# Altium schematic sheet DDR3.SchDoc
size A3
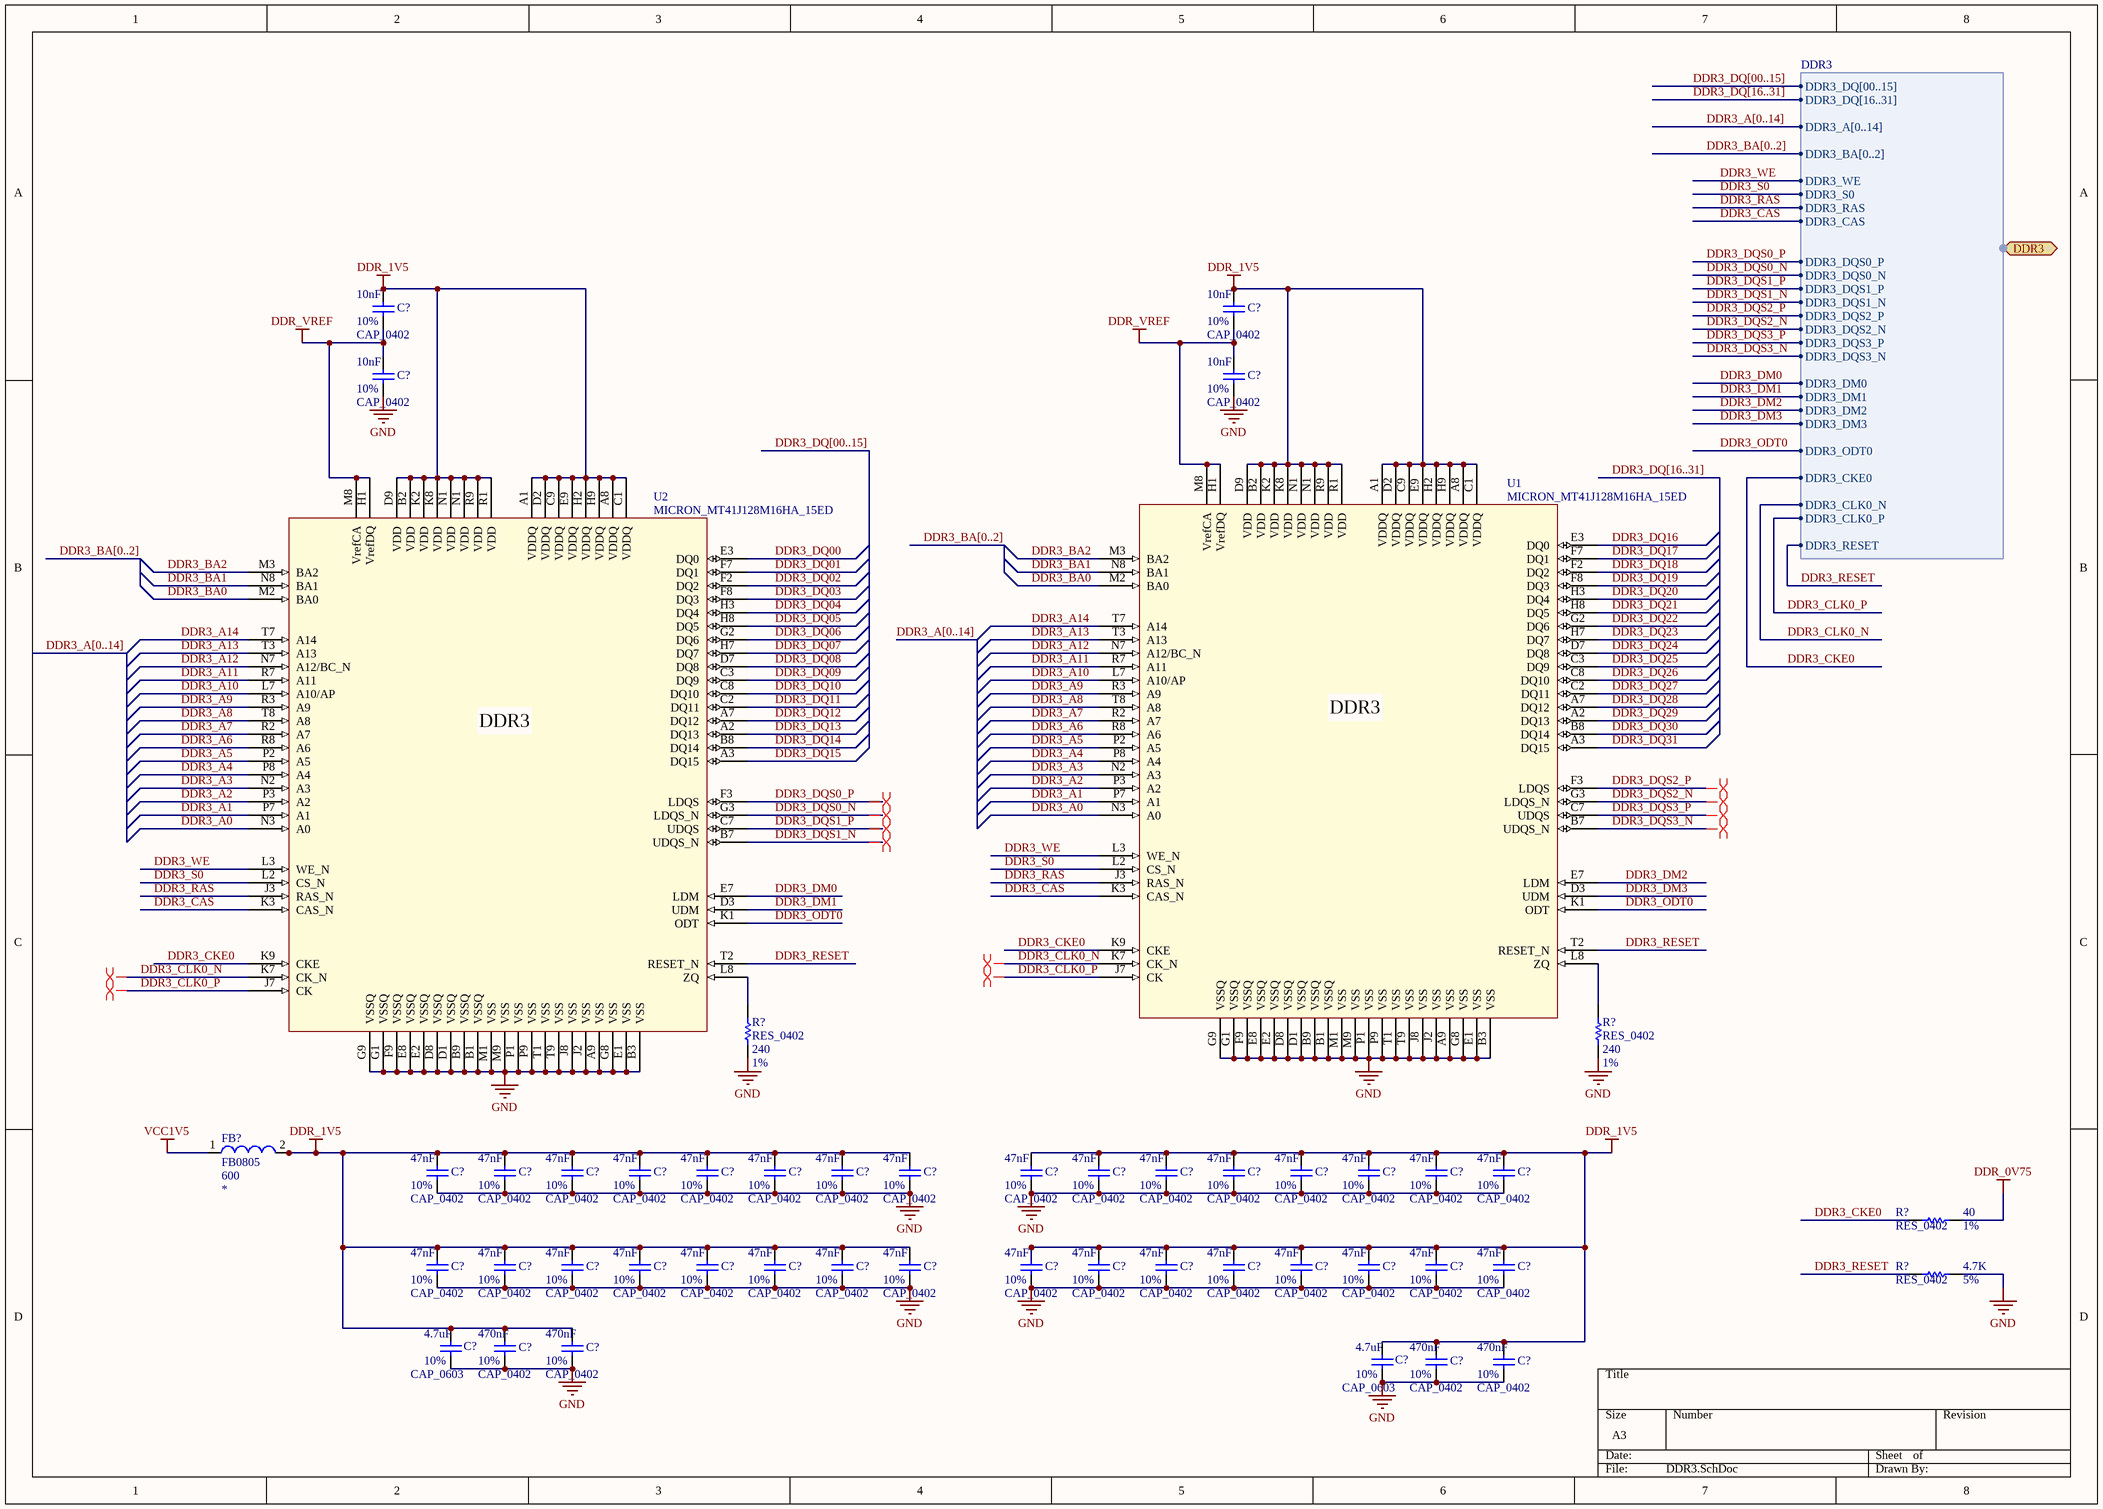
[diagram p0: DDR3.SchDoc]

## Parts
(Parts that share a designator on the sheet are numbered #1, #2 ... from top to bottom, then left to right.)
C?#1  CAP_0402  value 10nF  Tolerance: 10%  [CAPC0402(1005)60_N]
C?#2  CAP_0402  value 10nF  Tolerance: 10%  [CAPC0402(1005)60_N]
C?#3  CAP_0402  value 10nF  Tolerance: 10%  [CAPC0402(1005)60_N]
C?#4  CAP_0402  value 10nF  Tolerance: 10%  [CAPC0402(1005)60_N]
C?#5  CAP_0402  value 47nF  Tolerance: 10%  [CAPC0402(1005)60_N]
C?#6  CAP_0402  value 47nF  Tolerance: 10%  [CAPC0402(1005)60_N]
C?#7  CAP_0402  value 47nF  Tolerance: 10%  [CAPC0402(1005)60_N]
C?#8  CAP_0402  value 47nF  Tolerance: 10%  [CAPC0402(1005)60_N]
C?#9  CAP_0402  value 47nF  Tolerance: 10%  [CAPC0402(1005)60_N]
C?#10  CAP_0402  value 47nF  Tolerance: 10%  [CAPC0402(1005)60_N]
C?#11  CAP_0402  value 47nF  Tolerance: 10%  [CAPC0402(1005)60_N]
C?#12  CAP_0402  value 47nF  Tolerance: 10%  [CAPC0402(1005)60_N]
C?#13  CAP_0402  value 47nF  Tolerance: 10%  [CAPC0402(1005)60_N]
C?#14  CAP_0402  value 47nF  Tolerance: 10%  [CAPC0402(1005)60_N]
C?#15  CAP_0402  value 47nF  Tolerance: 10%  [CAPC0402(1005)60_N]
C?#16  CAP_0402  value 47nF  Tolerance: 10%  [CAPC0402(1005)60_N]
C?#17  CAP_0402  value 47nF  Tolerance: 10%  [CAPC0402(1005)60_N]
C?#18  CAP_0402  value 47nF  Tolerance: 10%  [CAPC0402(1005)60_N]
C?#19  CAP_0402  value 47nF  Tolerance: 10%  [CAPC0402(1005)60_N]
C?#20  CAP_0402  value 47nF  Tolerance: 10%  [CAPC0402(1005)60_N]
C?#21  CAP_0402  value 47nF  Tolerance: 10%  [CAPC0402(1005)60_N]
C?#22  CAP_0402  value 47nF  Tolerance: 10%  [CAPC0402(1005)60_N]
C?#23  CAP_0402  value 47nF  Tolerance: 10%  [CAPC0402(1005)60_N]
C?#24  CAP_0402  value 47nF  Tolerance: 10%  [CAPC0402(1005)60_N]
C?#25  CAP_0402  value 47nF  Tolerance: 10%  [CAPC0402(1005)60_N]
C?#26  CAP_0402  value 47nF  Tolerance: 10%  [CAPC0402(1005)60_N]
C?#27  CAP_0402  value 47nF  Tolerance: 10%  [CAPC0402(1005)60_N]
C?#28  CAP_0402  value 47nF  Tolerance: 10%  [CAPC0402(1005)60_N]
C?#29  CAP_0402  value 47nF  Tolerance: 10%  [CAPC0402(1005)60_N]
C?#30  CAP_0402  value 47nF  Tolerance: 10%  [CAPC0402(1005)60_N]
C?#31  CAP_0402  value 47nF  Tolerance: 10%  [CAPC0402(1005)60_N]
C?#32  CAP_0402  value 47nF  Tolerance: 10%  [CAPC0402(1005)60_N]
C?#33  CAP_0402  value 47nF  Tolerance: 10%  [CAPC0402(1005)60_N]
C?#34  CAP_0402  value 47nF  Tolerance: 10%  [CAPC0402(1005)60_N]
C?#35  CAP_0402  value 47nF  Tolerance: 10%  [CAPC0402(1005)60_N]
C?#36  CAP_0402  value 47nF  Tolerance: 10%  [CAPC0402(1005)60_N]
C?#37  CAP_0603  value 4.7uF  Tolerance: 10%  [CAPC0603(1608)100_N]
C?#38  CAP_0402  value 470nF  Tolerance: 10%  [CAPC0402(1005)60_N]
C?#39  CAP_0402  value 470nF  Tolerance: 10%  [CAPC0402(1005)60_N]
C?#40  CAP_0603  value 4.7uF  Tolerance: 10%  [CAPC0603(1608)100_N]
C?#41  CAP_0402  value 470nF  Tolerance: 10%  [CAPC0402(1005)60_N]
C?#42  CAP_0402  value 470nF  Tolerance: 10%  [CAPC0402(1005)60_N]
FB?  FB0805  Resistance: 600  [FerriteBead0805_WurthElectronik]
R?#1  RES_0402  value 240  Tolerance: 1%  [RESC0402(1005)_N]
R?#2  RES_0402  value 240  Tolerance: 1%  [RESC0402(1005)_N]
R?#3  RES_0402  value 40  Tolerance: 1%  [RESC0402(1005)_N]
R?#4  RES_0402  value 4.7K  Tolerance: 5%  [RESC0402(1005)_N]
U1  MICRON_MT41J128M16HA_15ED
U2  MICRON_MT41J128M16HA_15ED

## Ports
DDR3 (harness DDR3)

## Harnesses
DDR3: DDR3_DQ[00..15], DDR3_DQ[16..31], DDR3_A[0..14], DDR3_BA[0..2], DDR3_WE, DDR3_S0, DDR3_RAS, DDR3_CAS, DDR3_DQS0_P, DDR3_DQS0_N, DDR3_DQS1_P, DDR3_DQS1_N, DDR3_DQS2_P, DDR3_DQS2_N, DDR3_DQS3_P, DDR3_DQS3_N, DDR3_DM0, DDR3_DM1, DDR3_DM2, DDR3_DM3, DDR3_ODT0, DDR3_CKE0, DDR3_CLK0_N, DDR3_CLK0_P, DDR3_RESET

## Nets
DDR_0V75: R?#3.2
DDR_1V5: C?#1.2 C?#2.2 C?#5.2 C?#6.2 C?#7.2 C?#8.2 C?#9.2 C?#10.2 C?#11.2 C?#12.2 C?#13.2 C?#14.2 C?#15.2 C?#16.2 C?#17.2 C?#18.2 C?#19.2 C?#20.2 C?#21.2 C?#22.2 C?#23.2 C?#24.2 C?#25.2 C?#26.2 C?#27.2 C?#28.2 C?#29.2 C?#30.2 C?#31.2 C?#32.2 C?#33.2 C?#34.2 C?#35.2 C?#36.2 C?#37.2 C?#38.2 C?#39.2 C?#40.2 C?#41.2 C?#42.2 FB?.2 U1.A1(VDDQ) U1.A8(VDDQ) U1.B2(VDD) U1.C1(VDDQ) U1.C9(VDDQ) U1.D2(VDDQ) U1.D9(VDD) U1.E9(VDDQ) U1.H2(VDDQ) U1.H9(VDDQ) U1.K2(VDD) U1.K8(VDD) U1.N1(VDD) U1.R1(VDD) U1.R9(VDD) U2.A1(VDDQ) U2.A8(VDDQ) U2.B2(VDD) U2.C1(VDDQ) U2.C9(VDDQ) U2.D2(VDDQ) U2.D9(VDD) U2.E9(VDDQ) U2.H2(VDDQ) U2.H9(VDDQ) U2.K2(VDD) U2.K8(VDD) U2.N1(VDD) U2.R1(VDD) U2.R9(VDD)
DDR_VREF: C?#1.1 C?#2.1 C?#3.2 C?#4.2 U1.H1(VrefDQ) U1.M8(VrefCA) U2.H1(VrefDQ) U2.M8(VrefCA)
GND: C?#3.1 C?#4.1 C?#5.1 C?#6.1 C?#7.1 C?#8.1 C?#9.1 C?#10.1 C?#11.1 C?#12.1 C?#13.1 C?#14.1 C?#15.1 C?#16.1 C?#17.1 C?#18.1 C?#19.1 C?#20.1 C?#21.1 C?#22.1 C?#23.1 C?#24.1 C?#25.1 C?#26.1 C?#27.1 C?#28.1 C?#29.1 C?#30.1 C?#31.1 C?#32.1 C?#33.1 C?#34.1 C?#35.1 C?#36.1 C?#37.1 C?#38.1 C?#39.1 C?#40.1 C?#41.1 C?#42.1 R?#1.1 R?#2.1 R?#4.2 U1.A9(VSS) U1.B1(VSSQ) U1.B3(VSS) U1.B9(VSSQ) U1.D1(VSSQ) U1.D8(VSSQ) U1.E1(VSS) U1.E2(VSSQ) U1.E8(VSSQ) U1.F9(VSSQ) U1.G1(VSSQ) U1.G8(VSS) U1.G9(VSSQ) U1.J2(VSS) U1.J8(VSS) U1.M1(VSS) U1.M9(VSS) U1.P1(VSS) U1.P9(VSS) U1.T1(VSS) U1.T9(VSS) U2.A9(VSS) U2.B1(VSSQ) U2.B3(VSS) U2.B9(VSSQ) U2.D1(VSSQ) U2.D8(VSSQ) U2.E1(VSS) U2.E2(VSSQ) U2.E8(VSSQ) U2.F9(VSSQ) U2.G1(VSSQ) U2.G8(VSS) U2.G9(VSSQ) U2.J2(VSS) U2.J8(VSS) U2.M1(VSS) U2.M9(VSS) U2.P1(VSS) U2.P9(VSS) U2.T1(VSS) U2.T9(VSS)
VCC1V5: FB?.1
DDR3_A0: U1.N3(A0) U2.N3(A0)
DDR3_A1: U1.P7(A1) U2.P7(A1)
DDR3_A2: U1.P3(A2) U2.P3(A2)
DDR3_A3: U1.N2(A3) U2.N2(A3)
DDR3_A4: U1.P8(A4) U2.P8(A4)
DDR3_A5: U1.P2(A5) U2.P2(A5)
DDR3_A6: U1.R8(A6) U2.R8(A6)
DDR3_A7: U1.R2(A7) U2.R2(A7)
DDR3_A8: U1.T8(A8) U2.T8(A8)
DDR3_A9: U1.R3(A9) U2.R3(A9)
DDR3_A10: U1.L7(A10/AP) U2.L7(A10/AP)
DDR3_A11: U1.R7(A11) U2.R7(A11)
DDR3_A12: U1.N7(A12/BC_N) U2.N7(A12/BC_N)
DDR3_A13: U1.T3(A13) U2.T3(A13)
DDR3_A14: U1.T7(A14) U2.T7(A14)
DDR3_BA0: U1.M2(BA0) U2.M2(BA0)
DDR3_BA1: U1.N8(BA1) U2.N8(BA1)
DDR3_BA2: U1.M3(BA2) U2.M3(BA2)
DDR3_CAS: U1.K3(CAS_N) U2.K3(CAS_N) ; port DDR3.DDR3_CAS
DDR3_CKE0: R?#3.1 U1.K9(CKE) U2.K9(CKE) ; port DDR3.DDR3_CKE0
DDR3_CLK0_N: U1.K7(CK_N) U2.K7(CK_N) ; port DDR3.DDR3_CLK0_N
DDR3_CLK0_P: U1.J7(CK) U2.J7(CK) ; port DDR3.DDR3_CLK0_P
DDR3_DM0: U2.E7(LDM) ; port DDR3.DDR3_DM0
DDR3_DM1: U2.D3(UDM) ; port DDR3.DDR3_DM1
DDR3_DM2: U1.E7(LDM) ; port DDR3.DDR3_DM2
DDR3_DM3: U1.D3(UDM) ; port DDR3.DDR3_DM3
DDR3_DQ00: U2.E3(DQ0)
DDR3_DQ01: U2.F7(DQ1)
DDR3_DQ02: U2.F2(DQ2)
DDR3_DQ03: U2.F8(DQ3)
DDR3_DQ04: U2.H3(DQ4)
DDR3_DQ05: U2.H8(DQ5)
DDR3_DQ06: U2.G2(DQ6)
DDR3_DQ07: U2.H7(DQ7)
DDR3_DQ08: U2.D7(DQ8)
DDR3_DQ09: U2.C3(DQ9)
DDR3_DQ10: U2.C8(DQ10)
DDR3_DQ11: U2.C2(DQ11)
DDR3_DQ12: U2.A7(DQ12)
DDR3_DQ13: U2.A2(DQ13)
DDR3_DQ14: U2.B8(DQ14)
DDR3_DQ15: U2.A3(DQ15)
DDR3_DQ16: U1.E3(DQ0)
DDR3_DQ17: U1.F7(DQ1)
DDR3_DQ18: U1.F2(DQ2)
DDR3_DQ19: U1.F8(DQ3)
DDR3_DQ20: U1.H3(DQ4)
DDR3_DQ21: U1.H8(DQ5)
DDR3_DQ22: U1.G2(DQ6)
DDR3_DQ23: U1.H7(DQ7)
DDR3_DQ24: U1.D7(DQ8)
DDR3_DQ25: U1.C3(DQ9)
DDR3_DQ26: U1.C8(DQ10)
DDR3_DQ27: U1.C2(DQ11)
DDR3_DQ28: U1.A7(DQ12)
DDR3_DQ29: U1.A2(DQ13)
DDR3_DQ30: U1.B8(DQ14)
DDR3_DQ31: U1.A3(DQ15)
DDR3_DQS0_N: U2.G3(LDQS_N) ; port DDR3.DDR3_DQS0_N
DDR3_DQS0_P: U2.F3(LDQS) ; port DDR3.DDR3_DQS0_P
DDR3_DQS1_N: U2.B7(UDQS_N) ; port DDR3.DDR3_DQS1_N
DDR3_DQS1_P: U2.C7(UDQS) ; port DDR3.DDR3_DQS1_P
DDR3_DQS2_N: U1.G3(LDQS_N) ; port DDR3.DDR3_DQS2_N
DDR3_DQS2_P: U1.F3(LDQS) ; port DDR3.DDR3_DQS2_P
DDR3_DQS3_N: U1.B7(UDQS_N) ; port DDR3.DDR3_DQS3_N
DDR3_DQS3_P: U1.C7(UDQS) ; port DDR3.DDR3_DQS3_P
DDR3_ODT0: U1.K1(ODT) U2.K1(ODT) ; port DDR3.DDR3_ODT0
DDR3_RAS: U1.J3(RAS_N) U2.J3(RAS_N) ; port DDR3.DDR3_RAS
DDR3_RESET: R?#4.1 U1.T2(RESET_N) U2.T2(RESET_N) ; port DDR3.DDR3_RESET
DDR3_S0: U1.L2(CS_N) U2.L2(CS_N) ; port DDR3.DDR3_S0
DDR3_WE: U1.L3(WE_N) U2.L3(WE_N) ; port DDR3.DDR3_WE
NetR?#1_2: R?#1.2 U2.L8(ZQ)
NetR?#2_2: R?#2.2 U1.L8(ZQ)

## Buses and harness runs
bus DDR3_A[0..14]
bus DDR3_BA[0..2]
bus DDR3_DQ[00..15]
bus DDR3_DQ[16..31]

## Layout directives
differential pair: DDR3_CLK0_N, DDR3_CLK0_P, DDR3_DQS0_N, DDR3_DQS0_P, DDR3_DQS1_N, DDR3_DQS1_P, DDR3_DQS2_N, DDR3_DQS2_P, DDR3_DQS3_N, DDR3_DQS3_P

## Notes on the sheet
- (in symbol MICRON_MT41J128M16HA_15ED) DDR3

## Library data of the parts
FB? = FerriteBead0805: Ferrite Bead 0805; Max_Current: *